# EAGLE design iomodul3.1 (EAGLE 6.6.0)
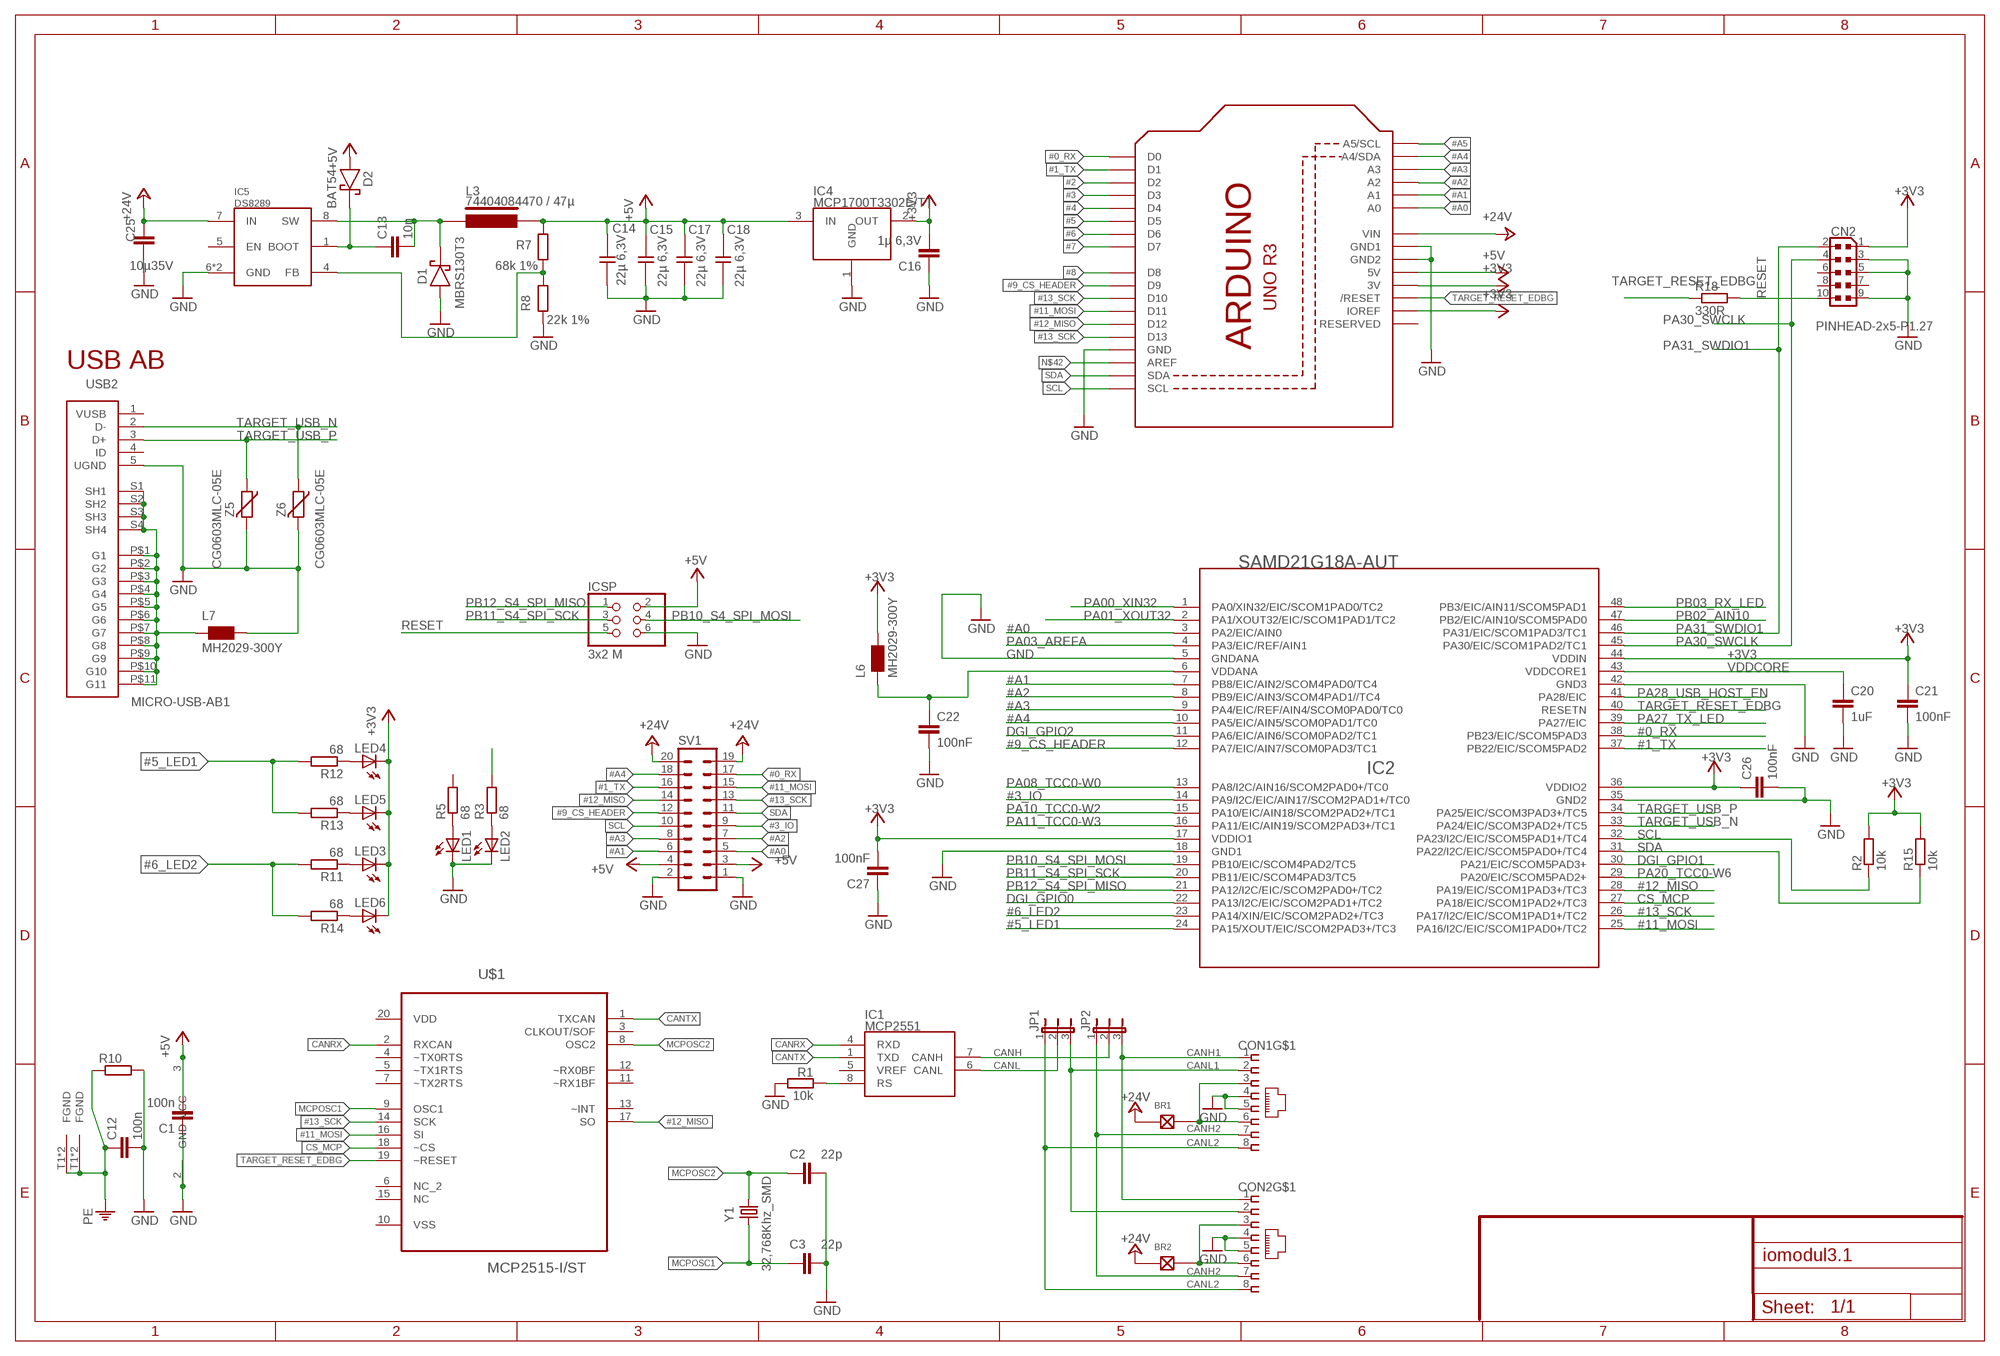
[diagram p0: schematic, sheet 1]

## Parts
BR1  LÖTBRÜCKE-S  [LÖTBRÜCKE]
BR2  LÖTBRÜCKE-S  [LÖTBRÜCKE]
C1  100n  C-EUC0805  [C0805]
C2  22p  C-EUC0805  [C0805]
C3  22p  C-EUC0805  [C0805]
C12  100n  C-EUC0805  [C0805]
C13  10n  C-EUC0805  [C0805]
C14  22µ 6,3V  CAP1210  [1210]
C15  22µ 6,3V  CAP1210  [1210]
C16  1µ 6,3V  C-EUC1206  [C1206]
C17  22µ 6,3V  CAP1210  [1210]
C18  22µ 6,3V  CAP1210  [1210]
C20  1uF  C-EUC0805  [C0805]
C21  100nF  C-EUC0805  [C0805]
C22  100nF  C-EUC0805  [C0805]
C25  10µ35V  C-EUC0805  [C0805]
C26  100nF  C-EUC0805  [C0805]
C27  100nF  C-EUC0805  [C0805]
CN2  PINHEAD-2x5-P1.27  0171_PH127-205DF055G00A  [PINHEAD-2X5-P127]
CON1  MEBP_8-8G  [MEBP]
CON2  MEBP_8-8G  [MEBP]
D1  MBRS130T3  [SMB]
D2  BAT54  [SOT23/32]
IC1  MCP2551  [SO-8]
IC2  SAMD21G18A-AUT  1792_SAMD21G18A-AUT  [TQFP48-7X7]
IC4  MCP1700T3302E/TT  MCP1700  [SOT23]
IC5  DS8289  [SO8-POWERPAD]
ICSP  3x2 M  0114_PH254-203DF118A00V  [2X03]
JP1  JP2E  [JP2]
JP2  JP2E  [JP2]
L3  74404084470 / 47µ  WE-LQS  [WE-LQS]
L6  MH2029-300Y  0001_BLM21PG300SN1D_/_MH2029-300Y  [0805]
L7  MH2029-300Y  0001_BLM21PG300SN1D_/_MH2029-300Y  [0805]
LED1  LEDCHIPLED_0805  [CHIPLED_0805]
LED2  LEDCHIPLED_0805  [CHIPLED_0805]
LED3  LEDCHIPLED_0805  [CHIPLED_0805]
LED4  LEDCHIPLED_0805  [CHIPLED_0805]
LED5  LEDCHIPLED_0805  [CHIPLED_0805]
LED6  LEDCHIPLED_0805  [CHIPLED_0805]
R1  10k  R-EU_R0805  [R0805]
R2  10k  R-EU_R0805  [R0805]
R3  68  R-EU_R0805  [R0805]
R5  68  R-EU_R0805  [R0805]
R7  68k 1%  R-EU_R0805  [R0805]
R8  22k 1%  R-EU_R0805  [R0805]
R10  R-EU_R0805  [R0805]
R11  68  R-EU_R0805  [R0805]
R12  68  R-EU_R0805  [R0805]
R13  68  R-EU_R0805  [R0805]
R14  68  R-EU_R0805  [R0805]
R15  10k  R-EU_R0805  [R0805]
R18  330R  R-EU_R0805  [R0805]
SV1  MA10-2  [MA10-2]
U1  ARDUINOR3-DIMENSION  [ARDUINOR3]
U$1  MCP2515-I/ST  [SOP65P640X110-20N]
USB2  MICRO-USB-AB1  0631_MCR-AB1-S-RA-SMT-TR  [MCR-AB1-S-RA-SMT]
Y1  32,768Khz_SMD  0213_ABS07-32.768KHZ-T  [RESONATOR_EPSON_FC_145]
Z5  CG0603MLC-05E  0010_BRNCG0603MLC-05E  [CT/CN0603]
Z6  CG0603MLC-05E  0010_BRNCG0603MLC-05E  [CT/CN0603]

## Nets
#0_RX: IC2.38(PB23/EIC/SCOM5PAD3) SV1.17 U1.D0
#1_TX: IC2.37(PB22/EIC/SCOM5PAD2) SV1.16 U1.D1
#2: U1.D2
#3: U1.D3
#3_IO: IC2.14(PA9/I2C/EIC/AIN17/SCOM2PAD1+/TC0) SV1.9
#4: U1.D4
#5: U1.D5
#5_LED1: IC2.24(PA15/XOUT/EIC/SCOM2PAD3+/TC3) R12.2 R13.2
#6: U1.D6
#6_LED2: IC2.23(PA14/XIN/EIC/SCOM2PAD2+/TC3) R11.2 R14.2
#7: U1.D7
#8: U1.D8
#9_CS_HEADER: IC2.12(PA7/EIC/AIN7/SCOM0PAD3/TC1) SV1.12 U1.D9
#11_MOSI: IC2.25(PA16/I2C/EIC/SCOM1PAD0+/TC2) SV1.15 U1.D11 U$1.16(SI)
#12_MISO: IC2.28(PA19/EIC/SCOM1PAD3+/TC3) SV1.14 U1.D12 U$1.17(SO)
#13_SCK: IC2.26(PA17/I2C/EIC/SCOM1PAD1+/TC2) SV1.13 U1.D10 U1.D13 U$1.14(SCK)
#A0: IC2.3(PA2/EIC/AIN0) SV1.5 U1.A0
#A1: IC2.7(PB8/EIC/AIN2/SCOM4PAD0/TC4) SV1.6 U1.A1
#A2: IC2.8(PB9/EIC/AIN3/SCOM4PAD1//TC4) SV1.7 U1.A2
#A3: IC2.9(PA4/EIC/REF/AIN4/SCOM0PAD0/TC0) SV1.8 U1.A3
#A4: IC2.10(PA5/EIC/AIN5/SCOM0PAD1/TC0) SV1.18
#A5: U1.A5(A5/SCL)
+3V3: C16.2 C21.1 C26.1 C27.2 CN2.1 IC2.17(VDDIO1) IC2.36(VDDIO2) IC2.44(VDDIN) IC4.2(OUT) L6.2 LED3.C LED4.C LED5.C LED6.C R2.2 R15.2 U1.3V U1.IOREF
+5V: C1.2 C14.2 C15.2 C17.2 C18.2 D2.1(A) IC1.3(VCC) IC4.3(IN) ICSP.2 L3.P$2 R7.2 SV1.3 SV1.4 U1.5V
+24V: BR1.1 BR2.1 C25.2 IC5.7(IN) SV1.19 SV1.20 U1.VIN
CANH: IC1.7(CANH) JP2.2
CANH1: CON1.1 CON2.1 JP2.3
CANH2: CON1.7 CON2.7 JP2.1
CANL: IC1.6(CANL) JP1.2
CANL1: CON1.2 CON2.2 JP1.3
CANL2: CON1.8 CON2.8 JP1.1
CANRX: IC1.4(RXD) U$1.2(RXCAN)
CANTX: IC1.1(TXD) U$1.1(TXCAN)
CS_MCP: IC2.27(PA18/EIC/SCOM1PAD2+/TC3) U$1.18(~CS)
DGI_GPIO0: IC2.22(PA13/I2C/EIC/SCOM2PAD1+/TC2)
DGI_GPIO1: IC2.30(PA21/EIC/SCOM5PAD3+)
DGI_GPIO2: IC2.11(PA6/EIC/AIN6/SCOM0PAD2/TC1)
GND: C1.1 C2.2 C3.2 C12.2 C14.1 C15.1 C16.1 C17.1 C18.1 C20.2 C21.2 C22.2 C25.1 C26.2 C27.1 CN2.3 CN2.5 CN2.9 CON1.4 CON1.5 CON2.4 CON2.5 D1.A IC1.2(GND) IC2.5(GNDANA) IC2.18(GND1) IC2.35(GND2) IC2.42(GND3) IC4.1(GND) IC5.6(GND) IC5.TP(GND) ICSP.6 L7.2 LED1.C LED2.C R1.2 R8.1 R10.2 SV1.1 SV1.2 U1.GND U1.GND1 U1.GND2 USB2.5(UGND) Z5.2 Z6.2
LED2: R3.2
MCPOSC1: C3.1 U$1.9(OSC1) Y1.P$1
MCPOSC2: C2.1 U$1.8(OSC2) Y1.P$2
N$1: IC1.8(RS) R1.1
N$2: BR1.2 CON1.3 CON1.6
N$3: LED2.A R3.1
N$4 [gnd]: L7.1 USB2.P$1(G1) USB2.P$2(G2) USB2.P$3(G3) USB2.P$4(G4) USB2.P$5(G5) USB2.P$6(G6) USB2.P$7(G7) USB2.P$8(G8) USB2.P$9(G9) USB2.P$10(G10) USB2.P$11(G11) USB2.S1(SH1) USB2.S2(SH2) USB2.S3(SH3) USB2.S4(SH4)
N$6: BR2.2 CON2.3 CON2.6
N$7: LED1.A R5.1
N$8: LED5.A R13.1
N$9: LED6.A R14.1
N$10: LED4.A R12.1
N$11: LED3.A R11.1
N$12: C13.1 D2.3(K) IC5.1(BOOT)
N$13: C13.2 D1.K IC5.8(SW) L3.P$1
N$15: C22.1 IC2.6(VDDANA) L6.1
N$18: IC5.4(FB) R7.1 R8.2
N$42: U1.AREF
PA00_XIN32: IC2.1(PA0/XIN32/EIC/SCOM1PAD0/TC2)
PA01_XOUT32: IC2.2(PA1/XOUT32/EIC/SCOM1PAD1/TC2)
PA03_AREFA: IC2.4(PA3/EIC/REF/AIN1)
PA08_TCC0-W0: IC2.13(PA8/I2C/AIN16/SCOM2PAD0+/TC0)
PA10_TCC0-W2: IC2.15(PA10/EIC/AIN18/SCOM2PAD2+/TC1)
PA11_TCC0-W3: IC2.16(PA11/EIC/AIN19/SCOM2PAD3+/TC1)
PA20_TCC0-W6: IC2.29(PA20/EIC/SCOM5PAD2+)
PA27_TX_LED: IC2.39(PA27/EIC)
PA28_USB_HOST_EN: IC2.41(PA28/EIC)
PA30_SWCLK: CN2.4 IC2.45(PA30/EIC/SCOM1PAD2/TC1)
PA31_SWDIO1: CN2.2 IC2.46(PA31/EIC/SCOM1PAD3/TC1)
PB02_AIN10: IC2.47(PB2/EIC/AIN10/SCOM5PAD0)
PB03_RX_LED: IC2.48(PB3/EIC/AIN11/SCOM5PAD1)
PB10_S4_SPI_MOSI: IC2.19(PB10/EIC/SCOM4PAD2/TC5) ICSP.4
PB11_S4_SPI_SCK: IC2.20(PB11/EIC/SCOM4PAD3/TC5) ICSP.3
PB12_S4_SPI_MISO: IC2.21(PA12/I2C/EIC/SCOM2PAD0+/TC2) ICSP.1
PE: C12.1 CON1.T1(FGND) CON1.T2(FGND) CON2.T1(FGND) CON2.T2(FGND) R10.1
RESET: CN2.10 ICSP.5 R18.2
SCL: IC2.32(PA23/I2C/EIC/SCOM5PAD1+/TC4) R2.1 SV1.10 U1.SCL
SDA: IC2.31(PA22/I2C/EIC/SCOM5PAD0+/TC4) R15.1 SV1.11 U1.SDA
TARGET_RESET_EDBG: IC2.40(RESETN) R18.1 U1.RESET(/RESET) U$1.19(~RESET)
TARGET_USB_N [USBpair]: IC2.33(PA24/EIC/SCOM3PAD2+/TC5) USB2.2(D-) Z6.1
TARGET_USB_P [USBpair]: IC2.34(PA25/EIC/SCOM3PAD3+/TC5) USB2.3(D+) Z5.1
VDDCORE: C20.1 IC2.43(VDDCORE1)
Unconnected: CN2.6 CN2.7 CN2.8 IC1.5(VREF) IC5.5(EN) R5.2 U1.A4(A4/SDA) U1.RESERVED U$1.3(CLKOUT/SOF) U$1.4(~TX0RTS) U$1.5(~TX1RTS) U$1.6(NC_2) U$1.7(~TX2RTS) U$1.11(~RX1BF) U$1.12(~RX0BF) U$1.13(~INT) U$1.15(NC) USB2.4(ID)

## Notes on the sheet
- USB AB

## Power pins joined to a net without a drawn wire
VDD: U$1.20(VDD)
VSS: U$1.10(VSS)
VUSB: USB2.1(VUSB)

## Library data of the parts
BR1 BR2 = myspecial:LÖTBRÜCKE
C1-C3 C12 C13 C16 C20-C22 C25-C27 = schlager_passiv:C-EU: CAPACITOR, European symbol
C14 C15 C17 C18 = MYPASS:CAP1210
CN2 = Connettori:0171_PH127-205DF055G00A: 2x5 PASSO 1,27
CON1 CON2 = myconn:MEBP_8-8G: Reichelt RJ45 geschirmt MEBP 8-8G
D1 = MYDISCR:MBRS130T3
D2 = MYDISCR:BAT54
IC1 = MYMCHIP:MCP2551: CAN Transceiver
IC2 = IntegratedCircuits:1792_SAMD21G18A-AUT: Atmel D21 32bit ARM Cortex-M0 microcontroller - 48 PIN TQFP 256KB flash memory + 32KB SRAM
IC4 = MYMCHIP:MCP1700: LDO 250mA
IC5 = MYRichtek:DS8289
ICSP = Connettori:0114_PH254-203DF118A00V: 3x2 M V h 8,5 mm p2,54; MONTHLY_USAGE: _____; PART_NUMBER: PH254-203DF118A00V; PRICE: _____; SUPPLIER: _____; TYPE: Connettori; VALUE: ICSP
JP1 JP2 = jumper:JP2E: JUMPER
L3 = myinductiv:WE-LQS
L6 L7 = Protezione:0001_BLM21PG300SN1D_/_MH2029-300Y: BLM21; MONTHLY_USAGE: _____; PART_NUMBER: BLM21PG300SN1D_/_MH2029-300Y; PRICE: _____; SUPPLIER: _____; TYPE: Protezione
LED1-LED6 = led:LED: LED OSRAM: - CHIPLED LG R971, LG N971, LY N971, LG Q971, LY Q971, LO R971, LY R971 LH N974, LH R974 LS Q976, LO Q976, LY Q976 LO Q996 - Hyper CHIPLED LW Q18S LB Q993, LB Q99A, LB R99A - SideLED LS A670, LO A670, LY A670, LG A670, LP A670 LB A673, LV A673, LT A673, LW A673 LH A674 LY A675 LS A676, LA A676, LO A676, LY A676, LW A676 LS A679, LY A679, LG A679 - Hyper Micro SIDELED® LS Y876, LA Y876, LO Y876, LY Y876 LT Y87S - SmartLED LW L88C, LW L88S LB L89C, LB L89S, LG L890 LS L89K, LO L89K, LY L89K LS L896, LA L896, LO L896, LY L896 - TOPLED LS T670, LO T670, LY T670, LG T670, LP T670 LSG T670, LSP T670, LSY T670, LOP T670, LYG T670 LG T671, LOG T671, LSG T671 LB T673, LV T673, LT T673, LW T673 LH T674 LS T676, LA T676, LO T676, LY T676, LB T676, LH T676, LSB T676, LW T676 LB T67C, LV T67C, LT T67C, LS T67K, LO T67K, LY T67K, LW E67C LS E67B, LA E67B, LO E67B, LY E67B, LB E67C, LV E67C, LT E67C LW T67C LS T679, LY T679, LG T679 LS T770, LO T770, LY T770, LG T770, LP T770 LB T773, LV T773, LT T773, LW T773 LH T774 LS E675, LA E675, LY E675, LS T675 LS T776, LA T776, LO T776, LY T776, LB T776 LHGB T686 LT T68C, LB T68C - Hyper Mini TOPLED® LB M676 - Mini TOPLED Santana® LG M470 LS M47K, LO M47K, LY M47K Source: http://www.osram.convergy.de LUXEON: - LUMILED® LXK2-PW12-R00, LXK2-PW12-S00, LXK2-PW14-U00, LXK2-PW14-V00 LXK2-PM12-R00, LXK2-PM12-S00, LXK2-PM14-U00 LXK2-PE12-Q00, LXK2-PE12-R00, LXK2-PE12-S00, LXK2-PE14-T00, LXK2-PE14-U00 LXK2-PB12-K00, LXK2-PB12-L00, LXK2-PB12-M00, LXK2-PB14-N00, LXK2-PB14-P00, LXK2-PB14-Q00 LXK2-PR12-L00, LXK2-PR12-M00, LXK2-PR14-Q00, LXK2-PR14-R00 LXK2-PD12-Q00, LXK2-PD12-R00, LXK2-PD12-S00 LXK2-PH12-R00, LXK2-PH12-S00 LXK2-PL12-P00, LXK2-PL12-Q00, LXK2-PL12-R00 Source: www.luxeon.com KINGBRIGHT: KA-3528ASYC Source: www.kingbright.com
R1-R3 R5 R7 R8 R10-R15 R18 = schlager_passiv:R-EU_: RESISTOR, European symbol
SV1 = con-lstb:MA10-2: PIN HEADER; OC_FARNELL: unknown; OC_NEWARK: unknown
U1 = schlager_modules:ARDUINOR3: This is a new object for the new Arduino R3 - with extra pins that you may want to use (such as IOref, and duplicated A4/A5
U$1 = CHIP_MCP:MCP2515-I/ST: Stand-Alone CAN Controller; MPN: MCP2515-I/ST; OC_FARNELL: 1196851; OC_NEWARK: 61K2946; PACKAGE: SOP-20; SUPPLIER: Microchip
USB2 = Connettori:0631_MCR-AB1-S-RA-SMT-TR: Usb Micro F/90 Smd Tipo AB; MONTHLY_USAGE: _____; PART_NUMBER: MCR-AB1-S-RA-SMT-TR; PRICE: _____; SUPPLIER: _____; TYPE: Connettori; VALUE: MCR-AB1-S-RA-SMT-TR
Y1 = Cristalli:0213_ABS07-32.768KHZ-T: 32,768KHz - SMD; MONTHLY_USAGE: _____; PART_NUMBER: ABS07-32.768KHZ-T; PRICE: _____; SUPPLIER: _____; TYPE: Cristalli
Z5 Z6 = Protezione:0010_BRNCG0603MLC-05E: CG0603MLC-05E; MONTHLY_USAGE: _____; PART_NUMBER: BRNCG0603MLC-05E; PRICE: _____; SUPPLIER: _____; TYPE: Protezione; VALUE: BRNCG0603MLC-05E

## Net classes
0 default: width 0.203 mm, drill 0.203 mm, clearance 0.178 mm
2 gnd: width 0.254 mm, drill 0.254 mm, clearance 0.178 mm
3 usbvcc: width 0.203 mm, drill 0.406 mm, clearance 0.178 mm
4 USBpair: width 0.254 mm, drill 0.406 mm, clearance 0.508 mm

## Board
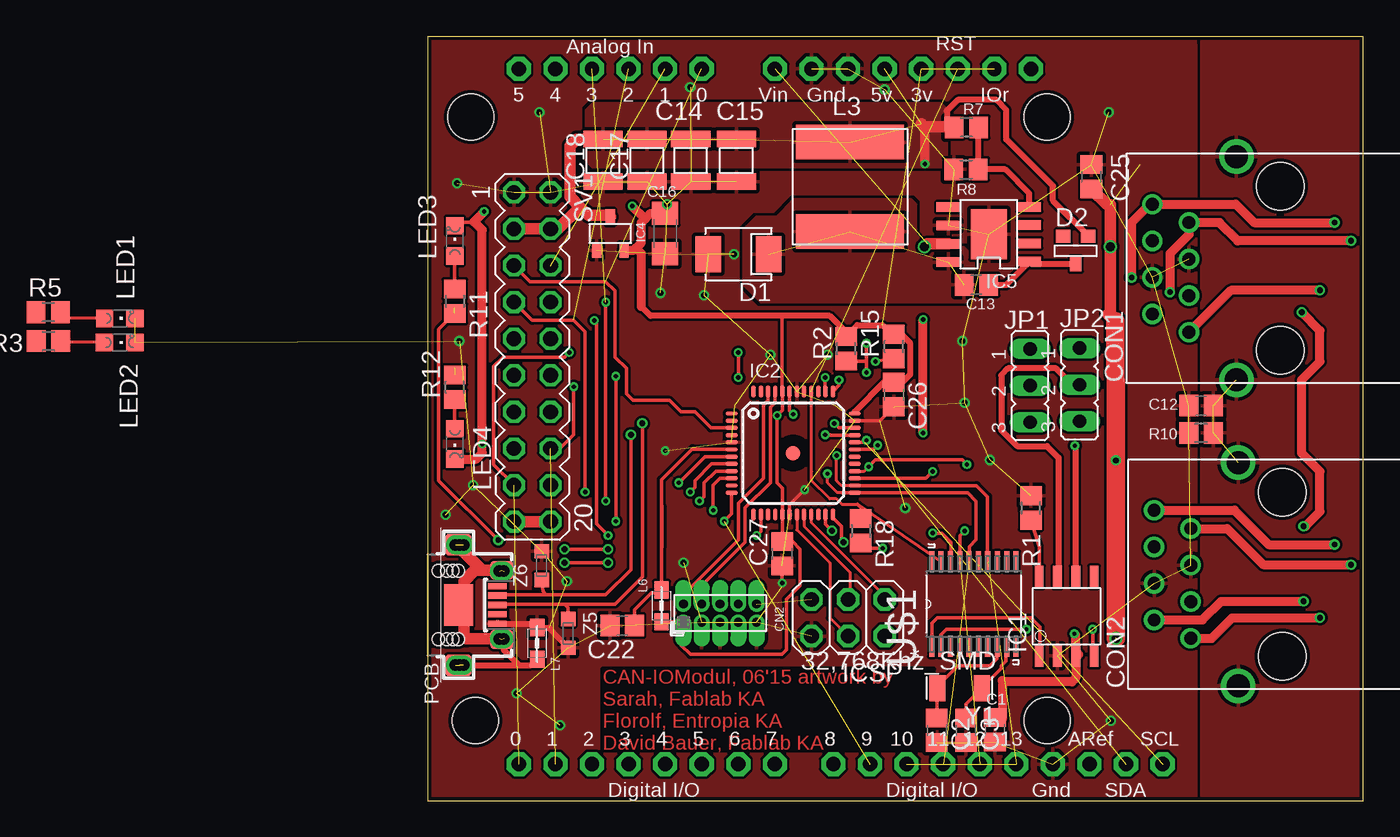
[diagram p1: board, top side]
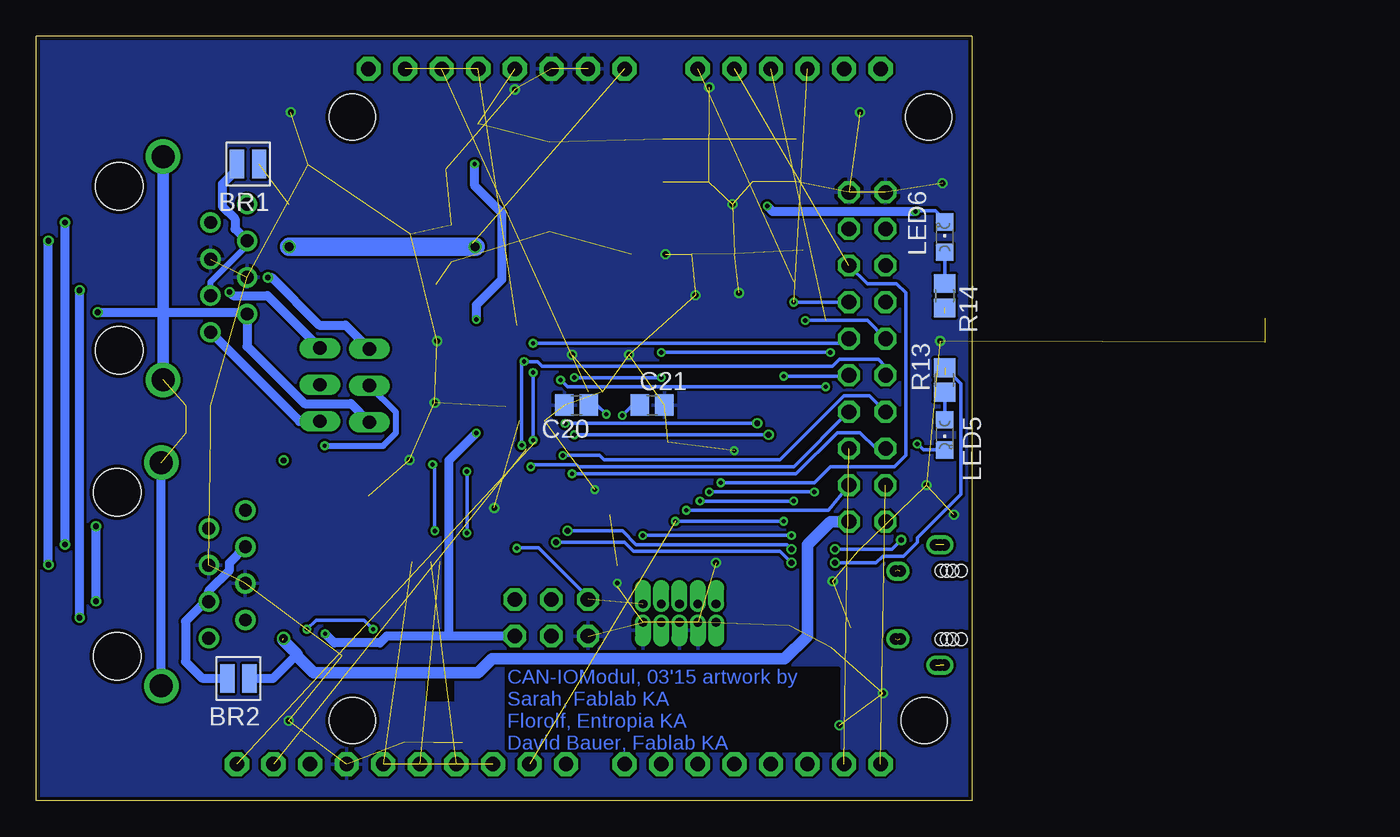
[diagram p2: board, bottom side, seen from below]

Size 65 x 53.08 mm. Coordinates in mm from the lower left corner, seen from the top.
Outline: 0,0 65,0 65,53.08 0,53.08 0,0
Copper layers (1*16): Top 0.035mm / dielectric 1.5mm / Bottom 0.035mm
Design rules "ITEADstudio_DRC": minimum track width 6mil, minimum drill 12mil, track to track 6mil, track to pad 6mil, pad to pad 6mil, via to via 6mil, smd to smd 0mil, copper to edge 10mil, drill to drill 10mil, minimum pad ring 10mil, minimum via ring 6mil, stop-mask expansion 2mil, vias tented up to drill 100mil, thermal gap 10mil
Holes 3.2 mm at 3.33,5.56 3.02,47.47 43.02,47.47 43.02,5.56

### Footprints (pad centres in the part's own frame; a part is rotated, then mirrored left to right if it is on the bottom)
LÖTBRÜCKE = smd 1 x 2: 1 -0.77,0; 2 0.77,0
C0805 = smd 1.3 x 1.5: 1 -0.85,0; 2 0.85,0
1210 = smd 1.143 x 2.718: 1 -1.473,0; 2 1.473,0
C1206 = smd 1.6 x 1.8: 1 -1.4,0; 2 1.4,0
PINHEAD-2X5-P127 = drill 0.61 pad 1.016 offset: 1 -0.635,2.54; 2 0.635,2.54; 3 -0.635,1.27; 4 0.635,1.27; 5 -0.635,0; 6 0.635,0; 7 -0.635,-1.27; 8 0.635,-1.27; 9 -0.635,-2.54; 10 0.635,-2.54
MEBP = drill 0.9: 1 -4.445,6.35; 2 -3.175,8.89; 3 -1.9,6.35; 4 -0.635,8.89; 5 0.635,6.35; 6 1.9,8.89; 7 3.175,6.35; 8 4.445,8.89 | drill 1.6: T1 -7.75,3.05; T2 7.75,3.05 | hole 3.3: -5.7,0; 5.7,0
SMB = smd 1.8 x 2.5: A 4.4,0; K 0.2,0
SOT23/32 = smd 1 x 0.9: 1 1.431,1.456; 2 -0.3,1.456 | smd 0.8 x 1: 3 0.565,-0.476
SO-8 = smd 0.61 x 1.524: 1 0,-0.203; 2 1.27,-0.203; 3 2.54,-0.203; 4 3.81,-0.203; 5 3.81,5.283; 6 2.54,5.283; 7 1.27,5.283; 8 0,5.283
TQFP48-7X7 = smd 0.85 x 0.32: 1 -4.275,2.75; 2 -4.275,2.25; 3 -4.275,1.75; 4 -4.275,1.25; 5 -4.275,0.75; 6 -4.275,0.25; 7 -4.275,-0.25; 8 -4.275,-0.75; 9 -4.275,-1.25; 10 -4.275,-1.75; 11 -4.275,-2.25; 12 -4.275,-2.75; 25 4.275,-2.75; 26 4.275,-2.25; 27 4.275,-1.75; 28 4.275,-1.25; 29 4.275,-0.75; 30 4.275,-0.25; 31 4.275,0.25; 32 4.275,0.75; 33 4.275,1.25; 34 4.275,1.75; 35 4.275,2.25; 36 4.275,2.75 | smd 0.32 x 0.85: 13 -2.75,-4.275; 14 -2.25,-4.275; 15 -1.75,-4.275; 16 -1.25,-4.275; 17 -0.75,-4.275; 18 -0.25,-4.275; 19 0.25,-4.275; 20 0.75,-4.275; 21 1.25,-4.275; 22 1.75,-4.275; 23 2.25,-4.275; 24 2.75,-4.275; 37 2.75,4.275; 38 2.25,4.275; 39 1.75,4.275; 40 1.25,4.275; 41 0.75,4.275; 42 0.25,4.275; 43 -0.25,4.275; 44 -0.75,4.275; 45 -1.25,4.275; 46 -1.75,4.275; 47 -2.25,4.275; 48 -2.75,4.275 | smd 1 x 1: P$1 0,0
SOT23 = smd 0.65 x 1.05: 1 -0.95,-1.15; 2 0.95,-1.15; 3 0,1.15
SO8-POWERPAD = smd 0.66 x 1.6: 1 -1.905,-2.819; 2 -0.635,-2.819; 3 0.635,-2.819; 4 1.905,-2.819; 5 1.88,2.819; 6 0.61,2.819; 7 -0.66,2.819; 8 -1.93,2.819 | smd 3.5 x 2.5: TP 0,0
2X03 = drill 1.016 pad 1.55 octagon: 1 -2.54,-1.27; 2 -2.54,1.27; 3 0,-1.27; 4 0,1.27; 5 2.54,-1.27; 6 2.54,1.27
JP2 = drill 0.914 long: 1 -2.54,0; 2 0,0; 3 2.54,0
WE-LQS = smd 2.4 x 7.5: P$1 3.1,0; P$2 -3.1,0
0805 = smd 1.2 x 1: 1 -1.1,0; 2 1.1,0
CHIPLED_0805 = smd 1.2 x 1.2: A 0,-1.05; C 0,1.05
R0805 = smd 1.3 x 1.5: 1 -0.85,0; 2 0.85,0
MA10-2 = drill 1.016 octagon: 1 -11.43,-1.27; 2 -11.43,1.27; 3 -8.89,-1.27; 4 -8.89,1.27; 5 -6.35,-1.27; 6 -6.35,1.27; 7 -3.81,-1.27; 8 -3.81,1.27; 9 -1.27,-1.27; 10 -1.27,1.27; 11 1.27,-1.27; 12 1.27,1.27; 13 3.81,-1.27; 14 3.81,1.27; 15 6.35,-1.27; 16 6.35,1.27; 17 8.89,-1.27; 18 8.89,1.27; 19 11.43,-1.27; 20 11.43,1.27
ARDUINOR3 = drill 1 pad 1.676 octagon: 3V 35.56,2.54; 5V 38.1,2.54; A0 50.8,2.54; A1 53.34,2.54; A2 55.88,2.54; A3 58.42,2.54; A4 60.96,2.54; A5 63.5,2.54; AREF 23.876,50.8; D0 63.5,50.8; D1 60.96,50.8; D2 58.42,50.8; D3 55.88,50.8; D4 53.34,50.8; D5 50.8,50.8; D6 48.26,50.8; D7 45.72,50.8; D8 41.656,50.8; D9 39.116,50.8; D10 36.576,50.8; D11 34.036,50.8; D12 31.496,50.8; D13 28.956,50.8; GND 26.416,50.8; GND1 43.18,2.54; GND2 40.64,2.54; IOREF 30.48,2.54; RESERVED 27.94,2.54; RESET 33.02,2.54; SCL 18.796,50.8; SDA 21.336,50.8; VIN 45.72,2.54
SOP65P640X110-20N = smd 1.422 x 0.356: 1 -2.946,2.921; 2 -2.946,2.286; 3 -2.946,1.626; 4 -2.946,0.965; 5 -2.946,0.33; 6 -2.946,-0.33; 7 -2.946,-0.965; 8 -2.946,-1.626; 9 -2.946,-2.286; 10 -2.946,-2.921; 11 2.946,-2.921; 12 2.946,-2.286; 13 2.946,-1.626; 14 2.946,-0.965; 15 2.946,-0.33; 16 2.946,0.33; 17 2.946,0.965; 18 2.946,1.626; 19 2.946,2.286; 20 2.946,2.921
MCR-AB1-S-RA-SMT = smd 0.4 x 1.35: 1 -1.3,2.7; 2 -0.65,2.7; 3 0,2.7; 4 0.65,2.7; 5 1.3,2.7 | drill 0.8: P$1 -4.175,0.356; P$3 -4.175,0.076; P$4 -4.175,-0.203; P$5 4.175,0.356; P$6 4.175,0.076; P$7 4.175,-0.203 | smd 2.9 x 2: P$2 0,0 | drill 0.8 pad 1.27: P$8 -2.35,3.15; P$9 -2.35,2.85; P$10 2.35,3.15; P$11 2.35,2.85 | smd 1.3 x 1.6: S1 -2.4,3; S2 2.4,3 | smd 1.5 x 1.8: S3 -4.175,0; S4 4.175,0 | hole 0.85: -2.375,0; 2.375,0; -2.375,-1.4; 2.375,-1.4; -2.375,-0.4; 2.375,-0.4; 2.375,-0.8; -2.375,-0.8
RESONATOR_EPSON_FC_145 = smd 1.1 x 1.8: P$1 -1.55,0; P$2 1.55,0
CT/CN0603 = smd 1 x 1: 1 -1,0; 2 1,0

### Placement (x,y rotation side)
BR1  50.28,44.19 180 bottom
BR2  50.95,8.48 180 bottom
C1  39.4,4.92 90 top
C2  35.37,4.89 270 top
C3  37.4,4.89 270 top
C12  53.72,27.43 180 top
C13  38.12,35.81 180 top
C14  18.29,44.45 90 top
C15  21.46,44.45 90 top
C16  16.51,39.37 90 top
C17  15.24,44.45 90 top
C18  12.19,44.45 90 top
C20  27.46,27.46 180 bottom
C21  22.23,27.46 0 bottom
C22  13.53,12.16 180 top
C25  46.1,43.31 270 top
C26  32.38,28.19 270 top
C27  24.64,17.14 90 top
CN2  20.32,13.02 90 top
CON1  59.23,36.96 90 top
CON2  59.35,15.72 90 top
D1  23.9,37.94 180 top
D2  44.45,37.72 0 top
IC1  42.48,10.26 0 top
IC2  25.4,24.13 0 top
IC4  12.7,39.37 0 top
IC5  38.98,39.32 90 top
ICSP  29.21,12.7 180 top
JP1  41.86,28.82 270 top
JP2  45.29,28.88 270 top
L3  29.35,42.61 270 top
L6  16.26,13.53 270 top
L7  7.62,10.92 90 top
LED1  -21.36,33.48 270 top  (outside the outline)
LED2  -21.36,31.81 270 top  (outside the outline)
LED3  1.91,38.86 0 top
LED4  1.91,24.77 180 top
LED5  1.91,25.4 180 bottom
LED6  1.91,39.12 0 bottom
R1  41.91,20.32 90 top
R2  29.08,31.37 90 top
R3  -26.31,31.9 180 top  (outside the outline)
R5  -26.33,33.91 180 top  (outside the outline)
R7  37.43,46.73 180 top
R8  37.4,43.82 0 top
R10  53.72,25.53 180 top
R11  1.91,34.67 270 top
R12  1.91,28.7 90 top
R13  1.91,29.21 90 bottom
R14  1.91,35.05 270 bottom
R15  32.38,31.53 90 top
R18  30.1,18.73 270 top
SV1  7.28,30.8 270 top
U1  69.85,53.34 180 top
U$1  37.94,13.65 90 top
USB2  2.16,13.59 270 top
Y1  36.96,7.81 180 top
Z5  9.78,11.62 270 top
Z6  7.94,16.32 90 top

### Tracks (layer width: path | path; a pad name or v marks a point on that pad's centre or on a via)
#0_RX  (via drill 0.3)  (1 unrouted)
  Top 0.254: v6.01,21.93 4.6,23.34 4.6,30.16 5.24,30.8 9.53,30.8 v9.84,31.11 | v21.59,31.11 v21.59,29.37 | v27.62,29.37 27.62,28.43 IC2.38
  Bottom 0.254: SV1.17 v6.01,21.93 | v9.84,31.11 v21.59,31.11 | v21.59,29.37 v27.62,29.37
#1_TX  (via drill 0.3)  (1 unrouted)
  Top 0.254: SV1.16 9.21,24.45 10.16,25.4 v10.16,28.73 | v28.57,29.21 28.57,28.83 IC2.37
  Bottom 0.254: v10.16,28.73 28.1,28.73 v28.57,29.21
#3_IO  (via drill 0.3)
  Top 0.254: v11.59,33.34 11.75,33.18 11.75,19.21 v12.54,18.41 | IC2.14 23.15,18.7 v22.86,18.41
  Bottom 0.254: v11.59,33.34 7.28,33.34 SV1.9 | v22.86,18.41 v12.54,18.41
#5_LED1  (via drill 0.4)  (1 unrouted)
  Top 0.254: IC2.24 28.15,19.63 28.73,19.05 28.73,18.1 v28.89,17.94 | v12.54,16.51 v9.53,16.51
  Bottom 0.254: v28.89,17.94 24.13,17.94 23.5,17.3 13.34,17.3 v12.54,16.51 | v9.53,16.51 6.67,16.51 6.19,16.99 4.76,16.99 3.81,17.94 3.81,18.26 0.79,21.27 0.79,28.95 R13.2
#6_LED2  (via drill 0.4)  (1 unrouted)
  Top 0.254: IC2.23 27.65,19.18 v28.1,18.73 | R11.2 0.79,32.71 0.79,22.23 v4.92,18.1 | v12.54,17.46 v9.53,17.46
  Bottom 0.254: v28.1,18.73 24.29,18.73 23.34,17.78 12.86,17.78 v12.54,17.46 | v9.53,17.46 5.56,17.46 v4.92,18.1
#9_CS_HEADER  (via drill 0.3)  (1 unrouted)
  Top 0.254: IC2.12 21.12,19.92 v20.61,19.4 | v13.08,19.4 v13.08,29.46
  Bottom 0.254: v13.08,29.46 8.62,29.46 SV1.12 | v13.08,19.4 v20.61,19.4
#11_MOSI  (via drill 0.3)  (1 unrouted)
  Top 0.203: 28.79,21.38 28.47,21.38 27.78,22.07 v27.78,22.7
  Top 0.254: 28.79,21.38 IC2.25 37.52,21.38 38.1,20.8 38.1,18.1 37.62,17.62 37.62,16.61 U$1.16 | 27.78,22.38 v27.78,22.7
  Bottom 0.254: SV1.15 6.67,24.45 7.78,25.56 9.37,25.56 12.22,22.7 v27.78,22.7
#12_MISO  (via drill 0.3)  (1 unrouted)
  Top 0.203: IC2.28 30.34,22.88 v30.64,23.18
  Top 0.254: U$1.17 36.98,18.4 v37.31,18.73 | v37.47,23.34 37.15,23.65 31.11,23.65 v30.64,23.18
  Bottom 0.254: SV1.14 8.57,26.99 12.38,23.18 27.3,23.18 27.46,23.34 30.48,23.34 v30.64,23.18 | v37.31,18.73 37.31,23.02 v37.47,23.34
#13_SCK  (via drill 0.3)  (2 unrouted)
  Top 0.203: IC2.26 28.76,21.88 28.42,22.23 v28.42,23.97
  Top 0.254: IC2.26 38.13,21.88 38.89,21.11 38.89,16.61 U$1.14
  Bottom 0.254: v28.42,23.97 25.88,23.97 25.56,23.65 13.34,23.65 8.89,28.1 7.12,28.1 SV1.13
#A0  (1 unrouted)
  Top 0.254: SV1.5 7.12,36.04 12.38,36.04 13.02,35.4 13.02,30.8 13.81,30 13.81,28.26 14.29,27.78 16.83,27.78 17.62,26.99 18.57,26.99 19.68,25.88 IC2.3
#A1  (via drill 0.3)  (1 unrouted)
  Top 0.254: IC2.7 19.28,23.88 v17.46,22.07
  Bottom 0.254: v17.46,22.07 10.95,22.07 9.84,23.18 5.4,23.18 4.6,23.97 4.6,35.24 5.24,35.88 7.28,35.88 SV1.6
#A2  (via drill 0.3)  (1 unrouted)
  Top 0.254: IC2.8 19.73,23.38 18.57,22.23 18.57,21.75 v18.26,21.43 | v10.95,21.43 10.95,32.54 10.16,33.34 7.28,33.34 SV1.7
  Bottom 0.254: v18.26,21.43 v10.95,21.43
#A3  (via drill 0.3)  (1 unrouted)
  Top 0.254: v12.38,20.8 v12.38,34.61 | IC2.9 20.02,22.88 19.21,22.07 19.21,21.11 v18.89,20.8
  Bottom 0.254: v18.89,20.8 v12.38,20.8 | v12.38,34.61 SV1.8
#A4  (via drill 0.3)
  Top 0.254: IC2.10 20.32,22.38 19.84,21.91 v19.84,20.16
  Bottom 0.254: v19.84,20.16 9.98,20.16 SV1.18
+3V3  (via drill 0.3)  (2 unrouted)
  Top 0.254: 32.98,29.04 C26.1 32.35,29.08 31.75,29.08 | 33.02,32.26 32.42,32.26 R15.2 | IC2.36 29.68,27.01 | L6.2 17.74,12.43 CN2.1 17.62,12.22 17.62,10.79 18.26,10.16 24.61,10.16 24.92,10.48 24.92,13.97 25.88,14.92 25.88,17.46 25.34,18 C27.2 IC2.17 24.65,21.7 24.29,22.07 v24.29,26.74 24.65,27.1 IC2.44 24.61,28.45 24.61,33.66 | 2.29,39.91 LED3.C 2.16,40.17 3.21,40.17 3.37,40.01 3.43,40.01
  Top 0.406: 32.98,29.04 33.53,29.59 33.53,31.75 33.02,32.26 | 29.68,27.01 31.75,29.08 | R15.2 31.58,33.02 29.84,33.02 29.08,32.26 R2.2 29.08,32.51 27.94,33.66 24.61,33.66 15.49,33.66 14.86,34.29
  Top 0.61: LED4.C 3.4,23.71 3.81,24.13 v3.81,24.77 3.81,39.62 3.43,40.01 | IC4.2 14.34,38.22 14.48,38.35 | 14.48,38.35 14.86,38.73 14.86,40.13 15.11,40.39 | 15.11,40.39 15.49,40.77 C16.2 | 3.21,40.17 v3.94,40.89 | v14.22,41.27 15.11,40.39 | 14.86,34.29 14.86,37.97 14.48,38.35
  Bottom 0.254: LED5.C 3.4,24.35 v3.81,24.77 | LED6.C 1.91,40.32 2.54,40.96 3.87,40.96 v3.94,40.89 | C21.1 23.57,27.46 v24.29,26.74
  Bottom 0.61: v3.94,40.89 13.84,40.89 v14.22,41.27
+5V  (via drill 0.3)  (6 unrouted)
  Top 0.406: D2.1 45.88,39.21 43.43,41.66 43.43,42.67 40.2,45.91 40.2,47.94 39.5,48.64 36.83,48.64 36.07,47.88 36.07,46.8 R7.2
  Top 0.61: IC1.3 45.02,10.35 45.21,10.16 | v34.42,25.53 v34.42,33.4 | v34.54,44.2 34.54,46.74 34.48,46.8 | IC1.3 45.02,8.51 44.77,8.26 40.01,8.26 39.91,8.35 39.91,5.65 C1.2 | IC1.3 45.02,11.49 v44.93,11.59
  Top 0.813: 36.07,46.8 34.48,46.8 34.29,46.99 | C18.2 10.36,45.92 9.91,45.47 9.91,41.91 10.6,41.21 | 10.6,41.21 11.18,40.64 12.58,40.64 IC4.3 | SV1.3 SV1.4 9.08,39.69 10.6,41.21
  Bottom 0.61: 36.32,11.43 36.32,23.62 v34.42,25.53 | v34.42,33.4 34.42,34.42 32.64,36.2 32.64,40.77 34.54,42.67 v34.54,44.2 | ICSP.2 36.32,11.43 | 36.32,11.43 40.64,11.43 41.12,10.95 44.29,10.95 v44.93,11.59
  pour Top (rank 3): 17.08,44 35.69,44 36.05,44.36 36.05,47.99 35.65,48.39 11.51,48.39 11.04,47.92 11.04,44.44 11.46,44.02 11.98,44.02
+24V  (via drill 0.4, 0.6)  (3 unrouted)
  Top 0.3: 47.62,25.21 47.79,25.38 | 47.8,24.23 47.8,24.6 47.79,24.6 | v47.8,23.62 47.8,23.11
  Top 0.6: 47.78,17.59 v47.81,11.27
  Top 0.8: IC5.7 34.72,38.66 v34.51,38.45
  Top 0.813: 47.25,33.78 47.42,33.61 | 47.42,33.61 v47.42,38.45 47.42,41.35 47.2,41.35 C25.2 | 47.42,33.61 47.76,33.27 | SV1.20 SV1.19
  Top 1.27: v47.81,11.27 v47.8,23.62 47.8,24.23 47.79,25.38 47.76,33.27
  Bottom 0.3: 47.77,23.59 v47.8,23.62
  Bottom 0.61: BR2.1 48.54,8.48 46.93,10.1 46.86,10.16
  Bottom 0.813: 46.86,10.16 47.88,11.18 | SV1.20 9.84,19.37 11.43,17.78 11.43,11.43 13.02,9.84 33.34,9.84 34.29,8.89 45.72,8.89 46.93,10.1
  Bottom 1.27: v47.42,38.45 v34.51,38.45 34.49,38.45
CANH
  Top 0.406: JP2.2 44.78,28.88 43.66,30 40.32,30 39.85,29.53 39.85,25.72 40.96,24.61 43.02,24.61 43.81,23.81 43.81,15.61 IC1.7
CANH1  (via drill 0.4)
  Top 0.61: CON2.1 54.45,11.28 55.88,12.7 v61.98,12.7 | v61.98,35.43 55.8,35.43 CON1.1
  Bottom 0.61: JP2.3 46.7,26.34 CON1.1 | v61.98,12.7 v61.98,35.43
CANH2  (via drill 0.4)
  Top 0.61: CON2.7 55.53,18.89 58.04,16.38 v64.14,16.38 | v64.14,38.86 56.26,38.86 54.99,40.13 CON1.7 52.88,39.29 51.56,37.97 v51.56,35.31
  Bottom 0.61: v64.14,16.38 v64.14,38.86 | v51.56,35.31 51.31,35.05 48.92,35.05 JP2.1
CANL  (via drill 0.3)
  Top 0.406: IC1.6 45.02,24.58 v44.96,24.64
  Bottom 0.406: v44.96,24.64 40.89,24.64 40.01,25.53 40.01,26.97 JP1.2
CANL1  (via drill 0.4)
  Top 0.61: CON2.2 53.82,12.54 55.12,13.84 v60.83,13.84 | v60.83,19.05 60.96,19.05 61.98,20.07 61.98,22.86 60.71,24.13 60.71,29.21 61.98,30.48 61.98,32.64 v60.71,33.91
  Bottom 0.61: JP1.3 43.13,27.56 46.35,27.56 50.34,31.54 CON1.2 50.46,33.91 v60.71,33.91 | v60.83,13.84 v60.83,19.05
CANL2  (via drill 0.4)
  Top 0.61: v62.99,40.13 57.4,40.13 56.13,41.41 CON1.8 50.17,41.41 48.9,40.13 v48.9,36.32 | CON2.8 56.03,20.16 58.42,17.78 v62.99,17.78
  Bottom 0.61: v62.99,40.13 v62.99,17.78 | v48.9,36.32 48.64,36.32 45.34,33.02 43.52,33.02 JP1.1
CANRX  (via drill 0.3)
  Top 0.254: U$1.2 35.66,11.53 36.04,11.91 v41.59,11.91 | v46.2,11.91 46.2,10.15 IC1.4
  Bottom 0.254: v41.59,11.91 42.23,12.54 45.56,12.54 v46.2,11.91
CANTX
  Top 0.254: U$1.1 35.02,12.32 35.4,12.7 41.91,12.7 42.55,12.06 42.55,10.13 IC1.1
CS_MCP  (via drill 0.3)
  Top 0.254: IC2.27 34.6,22.38 v35.08,22.86 | v35.08,18.57 35.72,18.57 36.35,17.94 36.35,16.64 U$1.18
  Bottom 0.254: v35.08,22.86 v35.08,18.57
GND  (via drill 0.3, 0.4)  (66 unrouted)
  Top 0.254: IC2.35 31.42,26.38 C26.2 | C27.1 v24.64,15.11 | IC2.18 25.15,20.55 v26.19,21.59
  Top 0.406: USB2.5 7.35,12.29 L7.2 8.45,12.02 Z5.2
  Bottom 0.254: v24.64,15.11 24.64,14.86
  other vias: 16.64,41.4 21.29,37.94 16.51,24.29 3.17,21.91 1.27,19.84 6.19,7.46 9.21,5.24 47.47,5.56 39.05,23.65 37.31,27.62 37.15,31.91 19.21,35.08 16.19,35.24 2.06,42.86 2.22,31.91 7.78,47.78 47.31,47.78 18.26,49.53 31.75,49.37 17.78,16.51 33.18,20.32 9.68,15.24 23.81,30.96 27.78,30.96
  pour Top (rank 5): -0.01,54.31 53.11,54.31 53.66,49.89 53.75,3.3 53.84,-5.03 0.03,-5.03 0.02,9.87 0.03,48.87
  pour Bottom (rank 3): 0,56.89 64.95,56.89 65.02,-6.35 0.07,-5.08
MCPOSC1
  Top 0.254: C3.1 37.4,6.71 Y1.P$1 38.51,7.87 39.85,9.21 39.85,9.37 40.16,9.68 40.16,10.64 U$1.9
MCPOSC2
  Top 0.254: C2.1 35.37,7.77 Y1.P$2 35.41,7.94 36.83,9.37 39.05,9.37 39.53,9.84 39.53,10.67 U$1.8
N$1
  Top 0.254: IC1.8 42.48,17.63 R1.1
N$2
  Bottom 0.406: CON1.3 52.88,36.02 50.34,38.56 CON1.6
  Bottom 0.61: BR1.2 51.05,43.82 52.07,42.8 52.07,41.27 51.18,40.39 51.18,39.7 CON1.6
N$3
  Top 0.203: LED2.A -25.37,31.81 R3.1
N$4  (10 unrouted)
  Top 0.406: USB2.P$6 6.35,9.41 | 6.35,9.41 7.21,9.41 L7.1 | USB2.P$10 5.31,10.46 6.35,9.41
  Top 0.813: USB2.P$11 2.73,11.24 2.54,11.43 2.54,13.21 USB2.P$2 2.54,13.97 2.54,15.24 3.29,15.99 3.81,15.99 | USB2.S1 3.81,15.99 | USB2.P$1 2.52,17.28 3.81,15.99
N$6
  Bottom 0.61: BR2.2 51.74,8.51 53.47,8.51 54.61,9.65 54.61,12.45 53.24,13.82 CON2.3 53,14.56 51.56,16 51.56,16.52 CON2.6
N$7
  Top 0.203: LED1.A -25.05,33.48 R5.1
N$8
  Bottom 0.254: R13.1 LED5.A
N$9
  Bottom 0.254: LED6.A R14.1
N$10
  Top 0.254: LED4.A R12.1
N$11
  Top 0.254: R11.1 LED3.A
N$12
  Top 0.4: C13.1 40.19,35.81 IC5.1
  Top 0.406: D2.3 41.97,37.24 IC5.1
N$13  (3 unrouted)
  pour Top (rank 4): 25.47,41.71 33.57,41.71 33.88,41.4 33.88,39.28 34.65,38.51 37.12,38.51 37.93,37.7 37.98,35.19 37.44,34.65 23.16,34.62 21.97,35.81 21.97,39.62 22.86,40.51 24.27,40.51
N$15
  Top 0.254: 16.28,20.48 L6.1 | L6.1 16.26,22.29 18.41,24.45 18.48,24.38 IC2.6 | C22.1 14.38,13.26 15.56,14.45 16.08,14.45 L6.1
N$18
  Top 0.406: IC5.4 41.8,42.15 40.13,43.81 38.83,43.81 R8.2 38.25,46.7 R7.1
PA30_SWCLK
  Top 0.254: CN2.4 19.05,14.92 22.07,17.94 22.07,20.32 23.81,22.07 23.81,27.3 24.13,27.62 24.13,28.39 IC2.45
PA31_SWDIO1
  Top 0.254: CN2.2 17.78,14.29 21.59,18.1 21.59,20.64 23.34,22.38 23.34,27.46 23.65,27.78 IC2.46
PB10_S4_SPI_MOSI
  Top 0.203: IC2.19 25.65,18.8 27.94,16.51 27.94,12.7 ICSP.4
PB11_S4_SPI_SCK
  Top 0.203: IC2.20 26.15,19.06 29.34,15.88 29.34,14.1 ICSP.3
PB12_S4_SPI_MISO
  Top 0.203: IC2.21 26.65,19.32 31.5,14.48 31.5,14.22 ICSP.1
PE  (3 unrouted)
  Bottom 0.61: CON2.T1 CON2.T2
  Bottom 0.813: CON1.T2 CON1.T1
  pour Top (rank 4): 53.77,54.35 65,54.35 65,-2.54 53.77,-2.54
RESET  (via drill 0.3)  (1 unrouted)
  Top 0.254: v31.62,17.53 30.14,17.53 R18.2
  Bottom 0.254: ICSP.5 26.67,14.14 30.1,17.57 31.58,17.57 v31.62,17.53
SCL  (via drill 0.3)  (1 unrouted)
  Top 0.254: v30.48,25.02 30.35,24.89 29.69,24.89 IC2.32 | v30.48,29.72 30.48,30.48 | 30.48,30.48 v30.48,31.75 | R2.1 30.44,30.52 30.48,30.48
  Bottom 0.254: SV1.10 8.57,32.07 8.89,31.75 v30.48,31.75 | v30.48,25.02 v30.48,29.72
SDA  (via drill 0.3)  (1 unrouted)
  Top 0.254: v31.27,24.67 30.99,24.38 IC2.31 | R15.1 31,30.52 v31.11,30.48
  Bottom 0.254: SV1.11 6.01,30.14 6.51,30.64 9.21,30.64 9.68,30.16 29.84,30.16 30.16,30.48 v31.11,30.48 31.27,30.32 v31.27,24.67
TARGET_RESET_EDBG  (1 unrouted)
  Top 0.203: U$1.19 29.84,20.57 28.8,20.57 28.42,20.95 27.94,20.95 26.67,22.23 26.67,22.86 26.65,22.88 IC2.40
  Top 0.254: R18.1 30.1,20.32 29.84,20.57
TARGET_USB_N  (via drill 0.3, 0.41)
  Top 0.254: IC2.33 27.96,25.38 27.94,25.4 v27.62,25.4 | v14.13,25.4 14.13,16.03 12.38,14.29 8.26,14.29 | 8.26,14.29 4.91,14.29 USB2.2 | Z6.1 8.02,14.53 8.26,14.29
  Bottom 0.254: v27.62,25.4 v14.13,25.4
TARGET_USB_P  (via drill 0.3, 0.41)
  Top 0.254: IC2.34 28.57,25.88 v28.26,26.19 | v14.92,26.19 14.92,15.56 13.02,13.65 9.53,13.65 | 9.53,13.65 4.92,13.65 USB2.3 | Z5.1 9.78,13.4 9.53,13.65
  Bottom 0.254: v28.26,26.19 v14.92,26.19
VDDCORE  (via drill 0.3)
  Top 0.254: IC2.43 25.15,27.08 v25.4,26.83
  Bottom 0.254: C20.1 26.04,27.46 v25.4,26.83

### Text on the board
Top: CAN-IOModul, 06'15 artwork by / Sarah, Fablab KA / Florolf, Entropia KA / David Bauer, Fablab KA
Bottom: CAN-IOModul, 03'15 artwork by / Sarah, Fablab KA / Florolf, Entropia KA / David Bauer, Fablab KA
_bNames: BR1 | BR2